# EAGLE design lcdork2 (EAGLE 5.06)
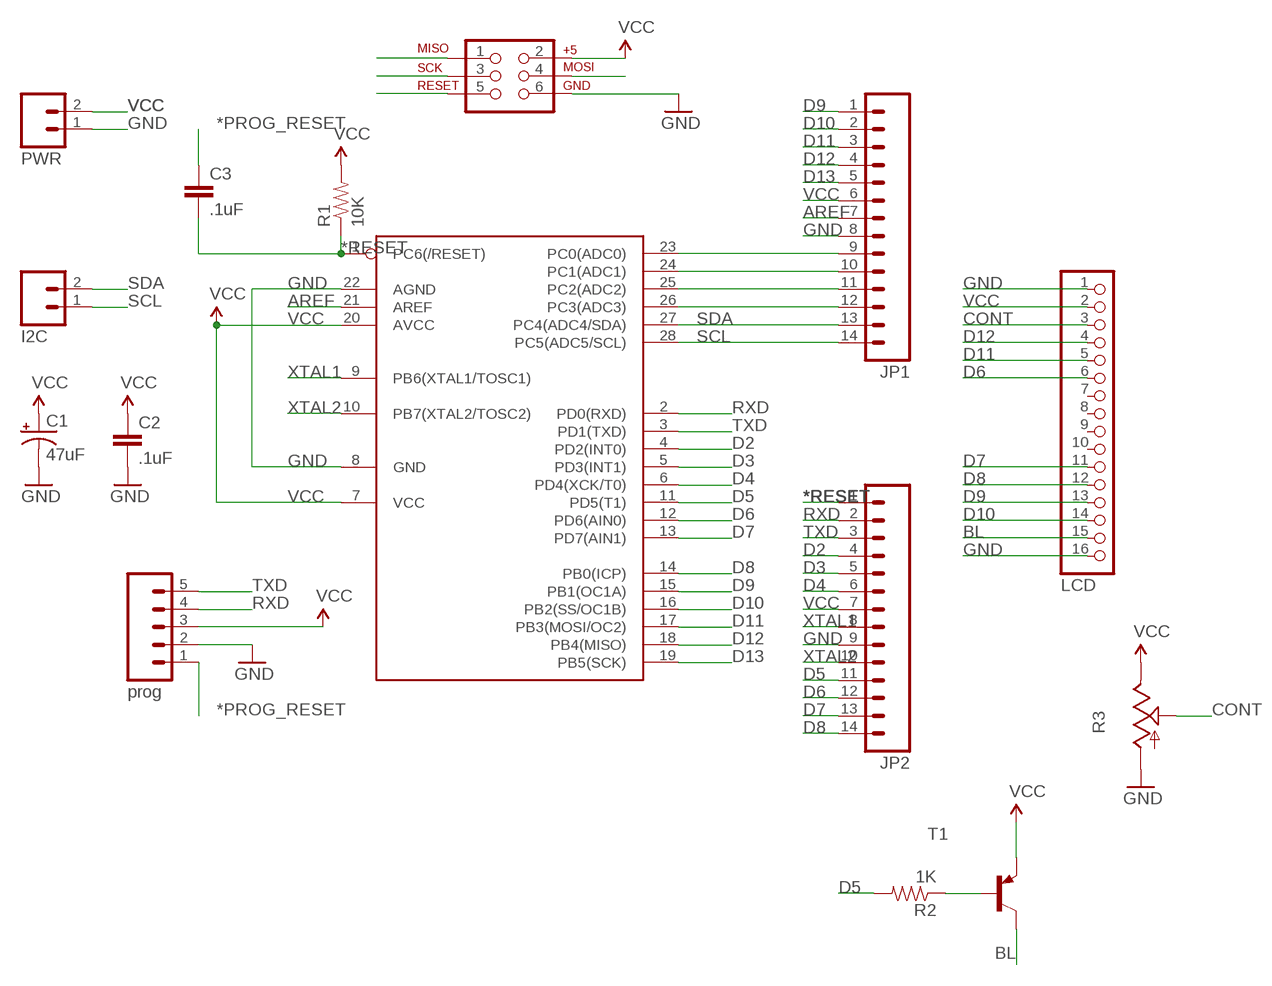
[diagram p0: schematic, sheet 1]

## Parts
C1  47uF  CAP_POLPTH2  [CPOL-RADIAL-10UF-25V]
C2  .1uF  CAP0805  [0805]
C3  .1uF  CAP0603-CAP  [0603-CAP]
I2C  I2C  M02PTH  [1X02]
IC1  MEGA168-P  MEGA8-P  [DIL28-3]
JP1  M14  [1X14]
JP2  M14  [1X14]
JP7  LCD  PINHD-1X16  [1X16]
PROG  prog  M05LOCK  [1X05_LOCK]
PWR  PWR  M02PTH  [1X02]
R1  10K  RESISTOR  [0805]
R2  1K  RESISTOR  [0805]
R3  TRIM_US-B64Y  [B64Y]
T1  2N3906-PNP-TO92-EBC  [TO92-EBC]
U$1  AVR_SPI_PRG_6NS  [2X3-NS]

## Nets
*PROG_RESET: C3.1 PROG.1
*RESET: C3.2 IC1.1(PC6(/RESET)) JP2.1 R1.1 U$1.5
AREF: IC1.21(AREF) JP1.7
BL: JP7.15 T1.C
CONT: JP7.3 R3.S
D2: IC1.4(PD2(INT0)) JP2.4
D3: IC1.5(PD3(INT1)) JP2.5
D4: IC1.6(PD4(XCK/T0)) JP2.6
D5: IC1.11(PD5(T1)) JP2.11 R2.2
D6: IC1.12(PD6(AIN0)) JP2.12 JP7.6
D7: IC1.13(PD7(AIN1)) JP2.13 JP7.11
D8: IC1.14(PB0(ICP)) JP2.14 JP7.12
D9: IC1.15(PB1(OC1A)) JP1.1 JP7.13
D10: IC1.16(PB2(SS/OC1B)) JP1.2 JP7.14
D11: IC1.17(PB3(MOSI/OC2)) JP1.3 JP7.5 U$1.4
D12: IC1.18(PB4(MISO)) JP1.4 JP7.4 U$1.1
D13: IC1.19(PB5(SCK)) JP1.5 U$1.3
GND: C1.2(-) C2.2 IC1.8(GND) IC1.22(AGND) JP1.8 JP2.9 JP7.1 JP7.16 PROG.2 PWR.1 R3.A U$1.6
N$1: IC1.23(PC0(ADC0)) JP1.9
N$2: IC1.24(PC1(ADC1)) JP1.10
N$3: IC1.25(PC2(ADC2)) JP1.11
N$4: IC1.26(PC3(ADC3)) JP1.12
N$7: R2.1 T1.B
RXD: IC1.2(PD0(RXD)) JP2.2 PROG.4
SCL: I2C.1 IC1.28(PC5(ADC5/SCL)) JP1.14
SDA: I2C.2 IC1.27(PC4(ADC4/SDA)) JP1.13
TXD: IC1.3(PD1(TXD)) JP2.3 PROG.5
VCC: C1.1(+) C2.1 IC1.7(VCC) IC1.20(AVCC) JP1.6 JP2.7 JP7.2 PROG.3 PWR.2 R1.2 R3.E T1.E U$1.2
XTAL1: IC1.9(PB6(XTAL1/TOSC1)) JP2.8
XTAL2: IC1.10(PB7(XTAL2/TOSC2)) JP2.10
Unconnected: JP7.7 JP7.8 JP7.9 JP7.10

## Library data of the parts
C1 = SparkFun:CAP_POL: Capacitor Polarized These are standard SMD and PTH capacitors. Normally 10uF, 47uF, and 100uF in electrolytic and tantalum varieties. Always verify the external diameter of the through hole cap, it varies with capacity, voltage, and manufacturer. The EIA devices should be standard.
C2 C3 = SparkFun:CAP: Capacitor Standard 0603 ceramic capacitor, and 0.1" leaded capacitor.
I2C PWR = SparkFun:M02: Header 2 Standard 2-pin 0.1" header. Use with straight break away headers (SKU : PRT-00116), right angle break away headers (PRT-00553), swiss pins (PRT-00743), machine pins (PRT-00117), and female headers (PRT-00115). Molex polarized connector foot print use with SKU : PRT-08233 with associated crimp pins and housings.
IC1 = atmel1:MEGA8-P: MICROCONTROLLER 8 Kbytes FLASH 1 kbytes SRAM 512 bytes EEPROM USART 4-channel 10 bit ADC 2-channel 8 bit ADC
JP1 JP2 = SparkFun:M14: Header 14 Standard 14-pin 0.1" header. Use with straight break away headers (SKU : PRT-00116), right angle break away headers (PRT-00553), swiss pins (PRT-00743), machine pins (PRT-00117), and female headers (PRT-00115).
JP7 = pinhead:PINHD-1X16: PIN HEADER
PROG = SparkFun:M05: Header 5 Standard 5-pin 0.1" header. Use with straight break away headers (SKU : PRT-00116), right angle break away headers (PRT-00553), swiss pins (PRT-00743), machine pins (PRT-00117), and female headers (PRT-00115). Molex polarized connector foot print use with SKU : PRT-08230 with associated crimp pins and housings.
R1 R2 = SparkFun:RESISTOR: Resistor Basic schematic elements and footprints for 0603, 1206, and PTH 1/10th watt (small) resistors.
R3 = pot:TRIM_US-: POTENTIOMETER
T1 = transistor-neu-to92:*-PNP-: PNP Transistror
U$1 = SparkFun:AVR_SPI_PRG_6: AVR ISP 6 Pin This is the reduced ISP connector for AVR programming. Common on Arduino. This footprint will take up less PCB space and can be used with a 10-pin to 6-pin adapter such as SKU: BOB-08508

## Board
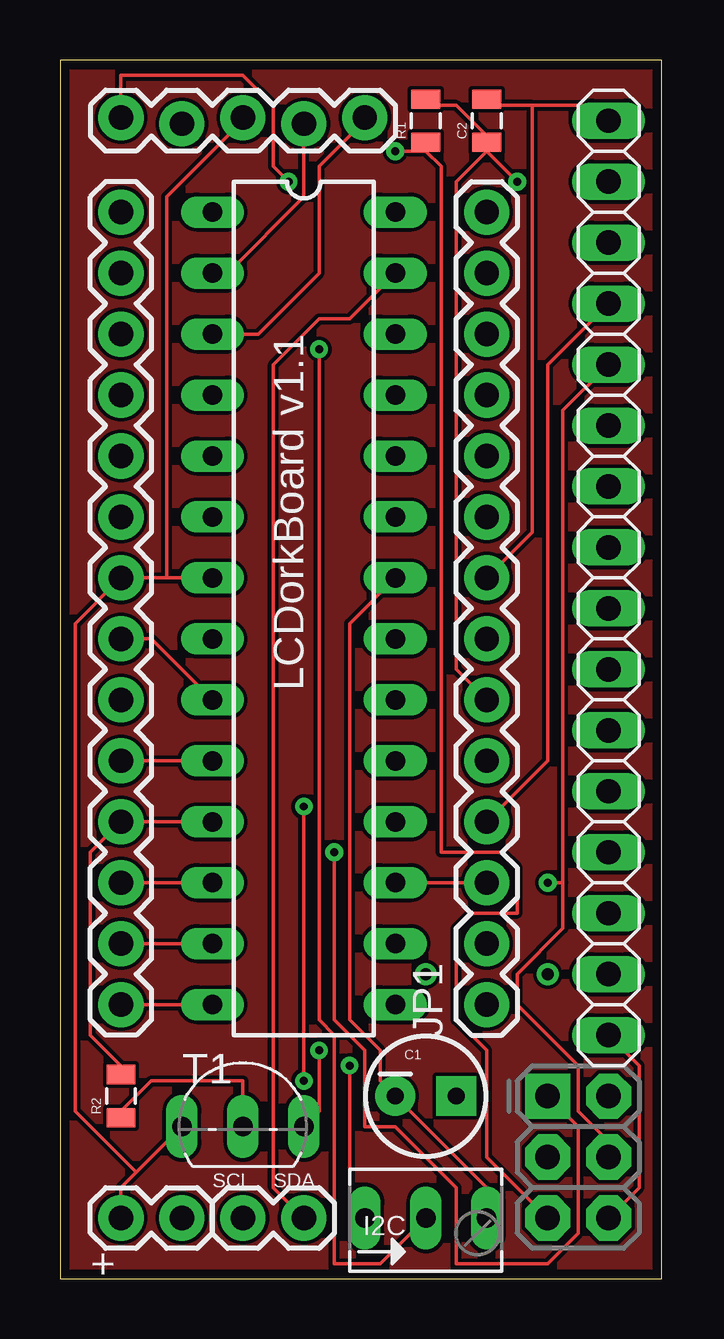
[diagram p1: board, top side]
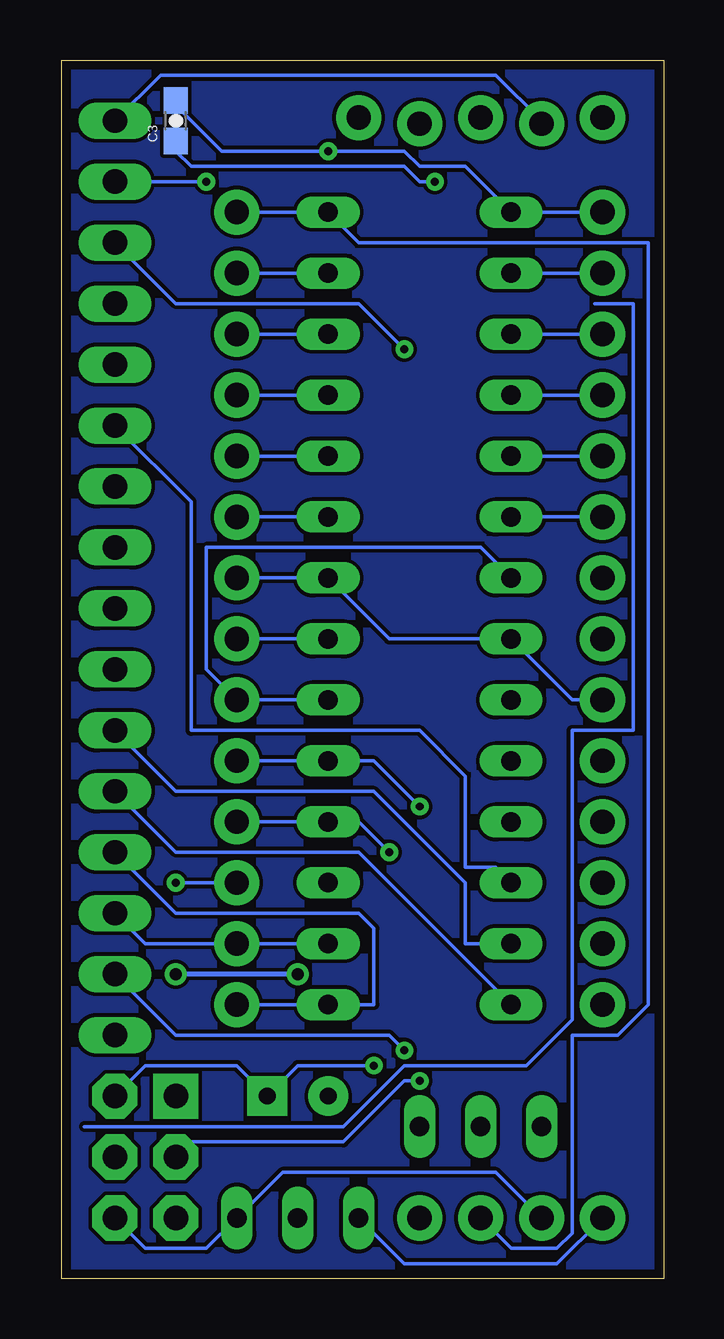
[diagram p2: board, bottom side, seen from below]

Size 25.07 x 50.79 mm. Coordinates in mm from the lower left corner, seen from the top.
Outline: 0,0 25.07,0 25.07,50.79 0,50.79 0,0
Copper layers (1*16): Top 0.0356mm / dielectric 1.5011mm / Bottom 0.0356mm
Design rules "LaenPCBOrder": minimum track width 6mil, minimum drill 13mil, track to track 6mil, track to pad 6mil, pad to pad 6mil, via to via 6mil, smd to smd 6mil, copper to edge 15mil, drill to drill 6mil, minimum pad ring 10mil, minimum via ring 8mil, stop-mask expansion 4mil, vias tented up to drill 0mil, thermal gap 10mil

### Footprints (pad centres in the part's own frame; a part is rotated, then mirrored left to right if it is on the bottom)
CPOL-RADIAL-10UF-25V = drill 0.7 pad 1.651 square: 1 1.27,0 | drill 0.7 pad 1.651 round: 2 -1.27,0
0805 = smd 0.8 x 1.2: 1 -0.9,0; 2 0.9,0
0603-CAP = smd 1.1 x 1: 1 -0.85,0; 2 0.85,0
1X02 = drill 1.016 pad 1.88 round: 1 0,0; 2 2.54,0
DIL28-3 = drill 0.813 long: 1 -16.51,-3.81; 2 -13.97,-3.81; 3 -11.43,-3.81; 4 -8.89,-3.81; 5 -6.35,-3.81; 6 -3.81,-3.81; 7 -1.27,-3.81; 8 1.27,-3.81; 9 3.81,-3.81; 10 6.35,-3.81; 11 8.89,-3.81; 12 11.43,-3.81; 13 13.97,-3.81; 14 16.51,-3.81; 15 16.51,3.81; 16 13.97,3.81; 17 11.43,3.81; 18 8.89,3.81; 19 6.35,3.81; 20 3.81,3.81; 21 1.27,3.81; 22 -1.27,3.81; 23 -3.81,3.81; 24 -6.35,3.81; 25 -8.89,3.81; 26 -11.43,3.81; 27 -13.97,3.81; 28 -16.51,3.81
1X14 = drill 1.016 pad 1.88 round: 1 0,0; 2 2.54,0; 3 5.08,0; 4 7.62,0; 5 10.16,0; 6 12.7,0; 7 15.24,0; 8 17.78,0; 9 20.32,0; 10 22.86,0; 11 25.4,0; 12 27.94,0; 13 30.48,0; 14 33.02,0
1X16 = drill 1.016 long: 1 -19.05,0; 2 -16.51,0; 3 -13.97,0; 4 -11.43,0; 5 -8.89,0; 6 -6.35,0; 7 -3.81,0; 8 -1.27,0; 9 1.27,0; 10 3.81,0; 11 6.35,0; 12 8.89,0; 13 11.43,0; 14 13.97,0; 15 16.51,0; 16 19.05,0
1X05_LOCK = drill 1.016 pad 1.88 round: 1 0,0.127; 2 2.54,-0.127; 3 5.08,0.127; 4 7.62,-0.127; 5 10.16,0.127
B64Y = drill 0.813 long: A 2.54,0; E -2.54,0; S 0,0
TO92-EBC = drill 0.813 long: B 0,-1.27; C 2.54,-1.27; E -2.54,-1.27
2X3-NS = drill 1.016 pad 1.88 square: 1 -2.54,-1.27 | drill 1.016 pad 1.88 octagon: 2 -2.54,1.27; 3 0,-1.27; 4 0,1.27; 5 2.54,-1.27; 6 2.54,1.27

### Placement (x,y rotation side)
C1  15.24,7.62 0 top
C2  17.78,48.26 90 top
C3  20.32,48.26 90 bottom
I2C  7.62,2.54 0 top
IC1  10.16,27.94 270 top
JP1  17.78,11.43 90 top
JP2  2.54,44.45 270 top
JP7  22.86,29.21 270 top
PROG  2.54,48.26 0 top
PWR  5.08,2.54 180 top
R1  15.24,48.26 90 top
R2  2.54,7.62 90 top
R3  15.24,2.54 0 top
T1  7.62,7.62 0 top
U$1  21.59,5.08 270 top

### Tracks (layer width: path | path; a pad name or v marks a point on that pad's centre or on a via)
*PROG_RESET  (via drill 0.33)
  Top 0.152: v9.53,45.72 8.89,46.35 8.89,48.9 7.62,50.16 2.54,50.16 PROG.1
  Bottom 0.152: v9.53,45.72 10.16,45.72 10.79,46.35 19.68,46.35 20.32,46.99 C3.1
*RESET  (via drill 0.33)
  Top 0.152: 15.24,46.99 v13.97,46.99 | U$1.5 17.78,5.08 17.78,9.53 16.51,10.79 16.51,14.61 17.14,15.24 19.05,15.24 19.05,17.14 18.41,17.78 15.88,17.78 15.88,46.35 15.24,46.99 | 15.24,46.99 R1.1
  Bottom 0.152: C3.2 20.32,48.9 18.41,46.99 v13.97,46.99 10.79,46.99 10.16,46.35 8.26,46.35 IC1.1 JP2.1
AREF
  Bottom 0.152: IC1.21 JP1.7
BL  (via drill 0.33)
  Top 0.152: T1.C 10.79,6.99 v10.79,9.53
  Bottom 0.152: v10.79,9.53 11.43,10.16 20.32,10.16 JP7.15
CONT  (via drill 0.33)
  Top 0.152: R3.S 13.34,0.64 11.43,0.64 11.43,10.16 10.79,10.79 v10.79,38.73
  Bottom 0.152: v10.79,38.73 12.7,40.64 20.32,40.64 JP7.3
D2
  Bottom 0.152: JP2.4 IC1.4
D3
  Bottom 0.152: JP2.5 IC1.5
D4
  Bottom 0.152: JP2.6 IC1.6
D5
  Top 0.152: R2.2 2.54,8.89 1.27,10.16 1.27,17.78 JP2.11 IC1.11
D6
  Top 0.152: JP2.12 IC1.12
  Bottom 0.152: JP7.6 19.68,32.38 19.68,22.86 10.16,22.86 8.26,20.95 8.26,17.14 6.99,17.14 IC1.12
D7
  Top 0.152: JP2.13 IC1.13
  Bottom 0.152: JP7.11 20.32,20.32 12.06,20.32 8.26,16.51 8.26,13.97 IC1.13
D8
  Top 0.152: JP2.14 IC1.14
  Bottom 0.152: JP7.12 20.32,17.78 12.7,17.78 IC1.14
D9
  Bottom 0.152: JP1.1 IC1.15 12.06,11.43 12.06,14.61 12.7,15.24 20.32,15.24 JP7.13
D10
  Bottom 0.152: IC1.16 JP1.2 21.59,13.97 JP7.14
D11  (via drill 0.33)
  Top 0.152: JP1.3 IC1.17 | JP7.5 20.95,36.2 20.95,16.51 | 20.95,16.51 20.95,14.61 19.05,12.7 19.05,11.43 21.59,8.89 21.59,6.99 22.86,5.71 U$1.4 | 20.95,16.51 v20.32,16.51
  Bottom 0.152: v20.32,16.51 JP1.3
D12  (via drill 0.33)
  Top 0.152: JP7.4 20.32,38.1 20.32,21.59 JP1.4 | U$1.1 21.59,6.35 21.59,1.91 20.32,0.64 16.51,0.64 16.51,3.81 13.97,6.35 12.7,6.35 12.7,9.53 11.43,10.79 v11.43,17.78
  Bottom 0.152: JP1.4 IC1.18 12.7,19.05 v11.43,17.78
D13  (via drill 0.33)
  Top 0.152: v10.16,8.26 v10.16,19.68
  Bottom 0.152: JP1.5 IC1.19 12.06,21.59 v10.16,19.68 | U$1.3 19.68,5.71 13.34,5.71 10.79,8.26 v10.16,8.26
GND
  Top 0.152: JP7.16 24.13,8.89 24.13,3.81 U$1.6 | R3.A 17.78,3.81 C1.2 13.34,8.26 13.34,9.53 12.06,10.79 12.06,27.3 IC1.22 | 19.68,48.9 22.86,48.9 JP7.1 | 19.68,48.9 17.78,48.9 C2.2 | 19.68,48.9 19.68,31.11 JP1.8
  Bottom 0.152: U$1.6 21.59,1.27 19.05,1.27 R3.A 15.88,4.45 6.99,4.45 PWR.1 | JP7.1 20.95,50.16 6.99,50.16 5.08,48.26 PROG.2 | JP1.8 IC1.22 11.43,26.67 IC1.8 3.81,24.13 JP2.9
N$1
  Bottom 0.152: IC1.23 JP1.9
N$2
  Bottom 0.152: IC1.24 JP1.10
N$3
  Bottom 0.152: IC1.25 JP1.11
N$4
  Bottom 0.152: IC1.26 JP1.12
N$5  (via drill 0.51)
  Bottom 0.203: v15.24,12.7 v20.32,12.7
N$6
  Bottom 0.152: 2.86,40.64 1.27,40.64 1.27,22.86 2.54,22.86 | 2.54,22.86 2.22,22.86 | 2.54,22.86 2.86,22.86 | 2.54,22.86 3.81,22.86 3.81,10.79 5.71,8.89 10.79,8.89 13.34,6.35 24.13,6.35
N$7
  Top 0.152: T1.B 7.62,8.26 3.81,8.26 2.54,6.99 R2.1
N$8
  pour Bottom: 0,50.8 25.4,50.8 25.4,0 0,0
N$9
  pour Top: 0,50.8 25.4,50.8 25.4,0 0,0
RXD
  Top 0.152: IC1.2 6.99,41.91 10.16,45.09 PROG.4
  Bottom 0.152: JP2.2 IC1.2
SCL
  Bottom 0.152: JP1.14 IC1.28 12.7,43.18 0.64,43.18 0.64,11.43 1.91,10.16 3.81,10.16 3.81,1.91 4.45,1.27 6.35,1.27 I2C.1
SDA
  Top 0.152: I2C.2 8.89,3.81 8.89,38.1 10.79,40.01 12.06,40.01 IC1.27
  Bottom 0.152: IC1.27 JP1.13
TXD
  Top 0.152: IC1.3 8.26,39.37 10.79,41.91 10.79,46.35 12.7,48.26 PROG.5
  Bottom 0.152: JP2.3 IC1.3
VCC  (via drill 0.33)
  Top 0.152: R1.2 15.24,48.9 16.51,48.9 17.78,47.62 C2.1 17.78,46.99 | 17.78,46.99 16.51,45.72 16.51,25.4 JP1.6 | 17.78,46.99 v19.05,45.72 | 4.45,29.21 JP2.7 0.64,27.3 0.64,6.99 3.17,4.45 | 4.45,29.21 IC1.7 | 4.45,29.21 4.45,45.09 7.62,48.26 PROG.3 | 3.17,4.45 2.54,3.81 PWR.2 | 3.17,4.45 T1.E | v12.06,8.89 12.06,3.17 R3.E
  Bottom 0.152: IC1.20 JP1.6 19.05,25.4 19.05,30.48 7.62,30.48 IC1.7 | v19.05,45.72 JP7.2 | U$1.2 21.59,8.89 17.78,8.89 C1.1 15.24,8.89 v12.06,8.89 | R3.E 10.79,0.64 4.45,0.64 PWR.2
XTAL1
  Top 0.152: IC1.9 3.81,26.67 JP2.8
XTAL2
  Top 0.152: JP2.10 IC1.10

### Text on the board
tNames: LCDorkBoard v1.1 | SCL | SDA | +